# EAGLE design PLnew (EAGLE 9.4.2)
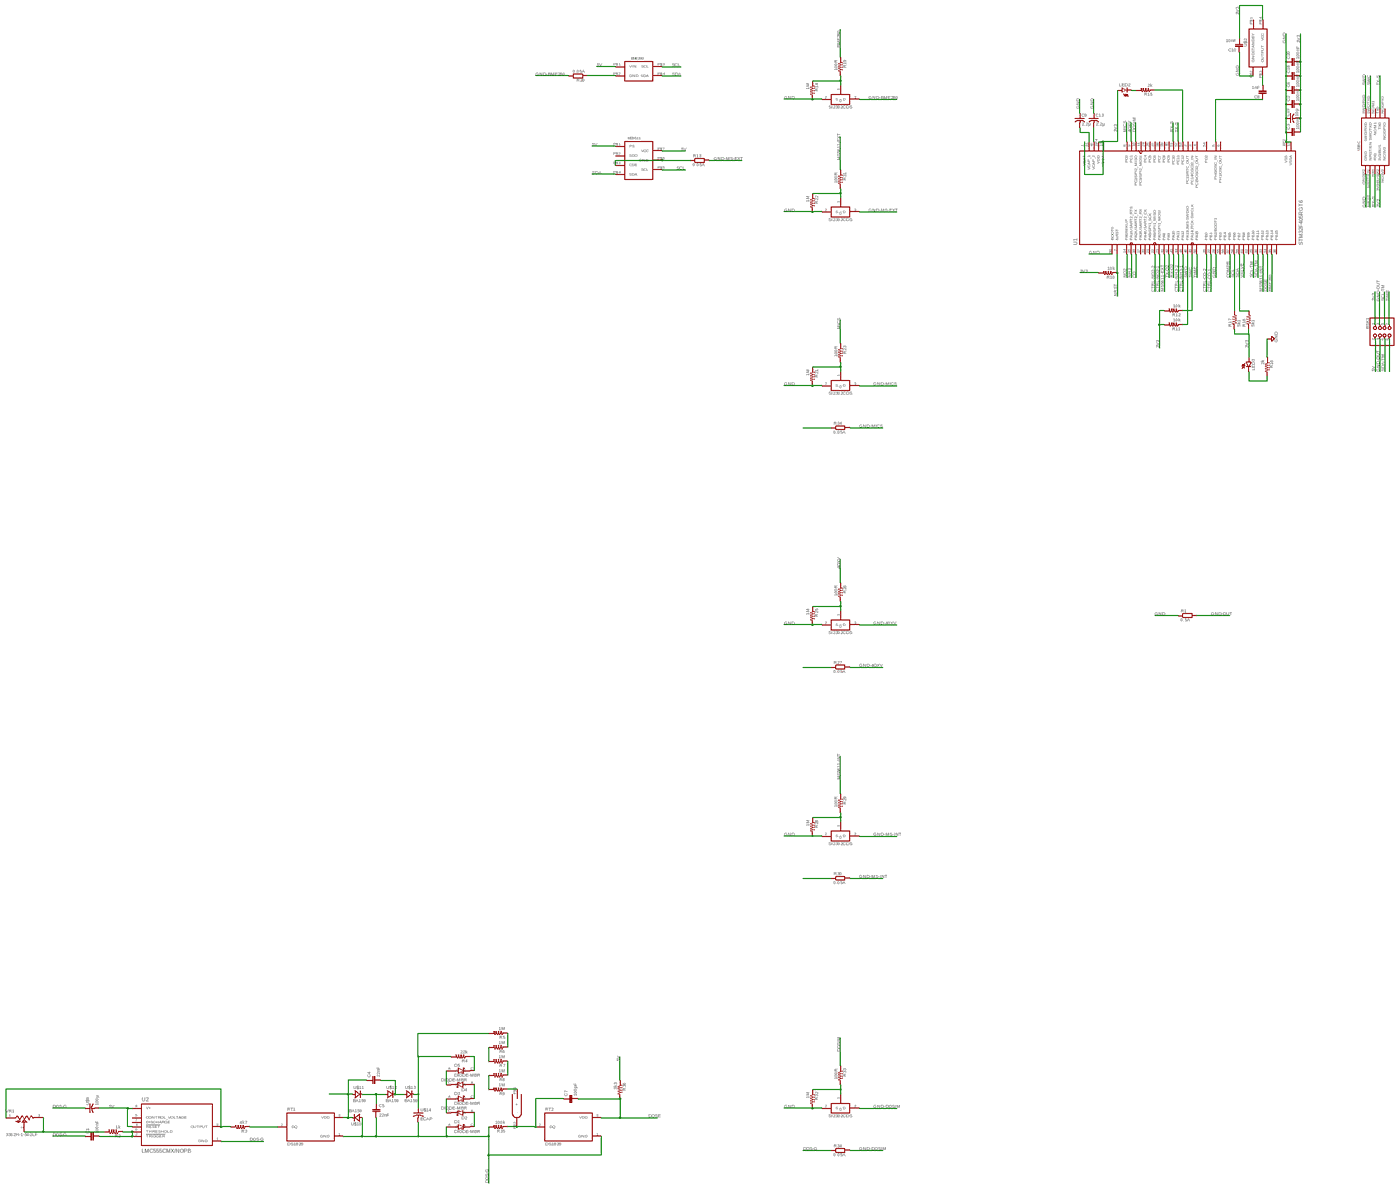
[diagram p0: schematic, sheet 1, overview]
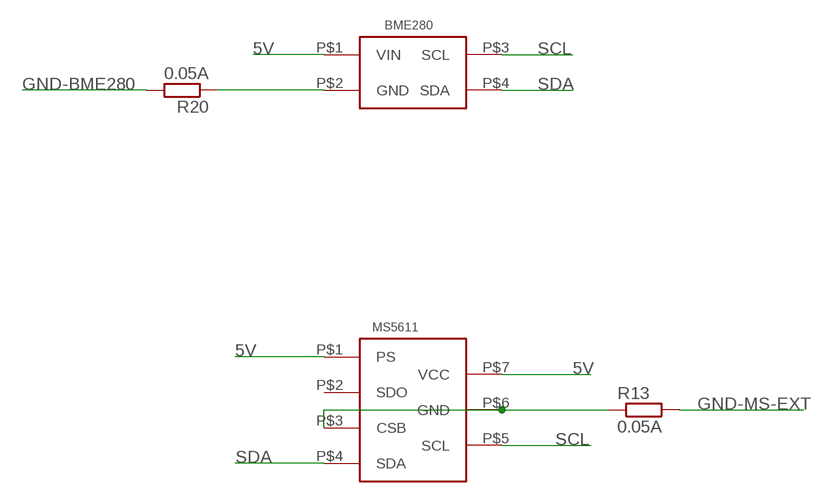
[diagram p1: schematic, sheet 1, part 1 of 4]
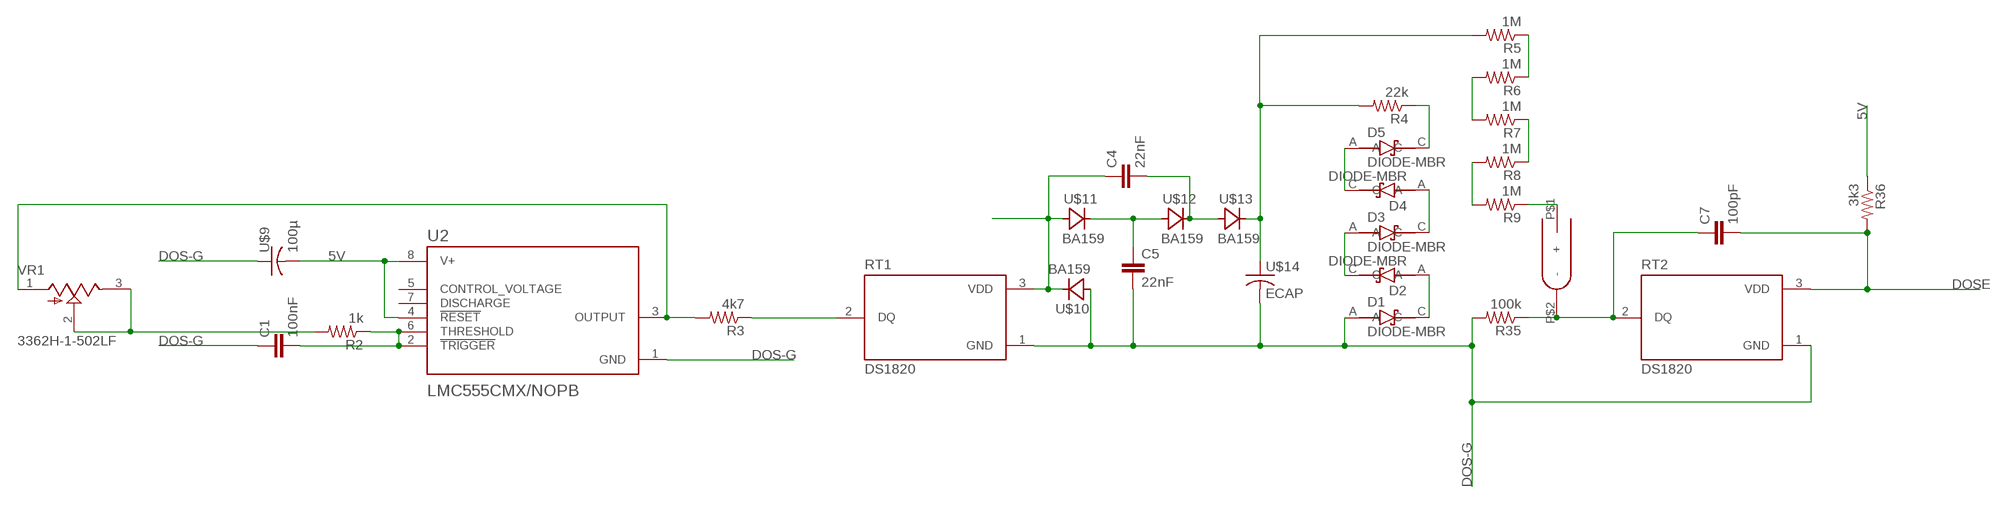
[diagram p2: schematic, sheet 1, part 2 of 4]
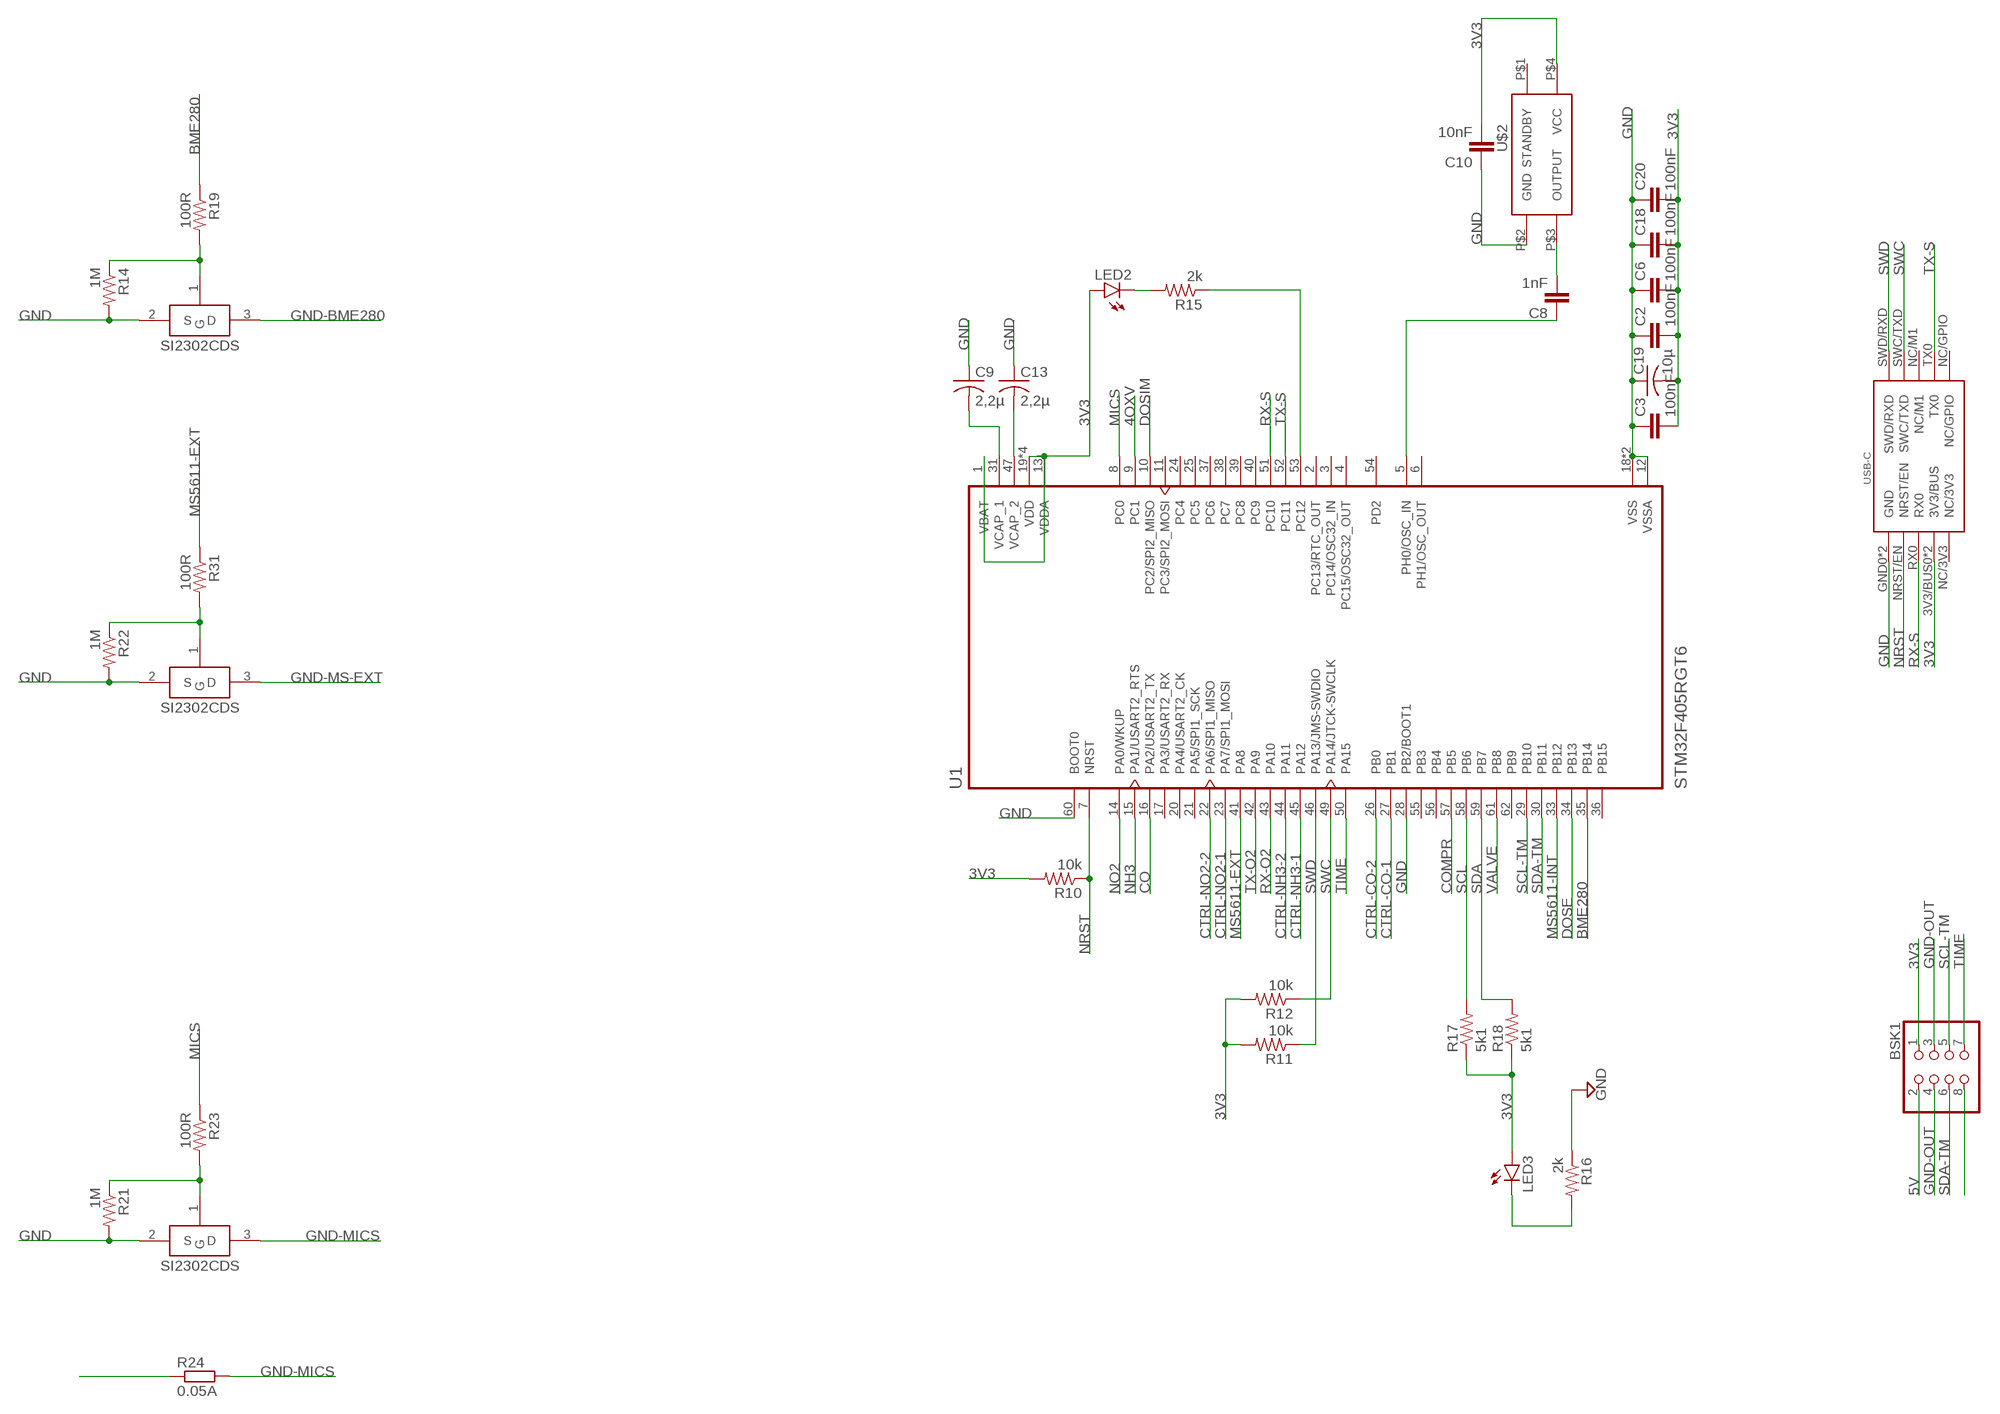
[diagram p3: schematic, sheet 1, part 3 of 4]
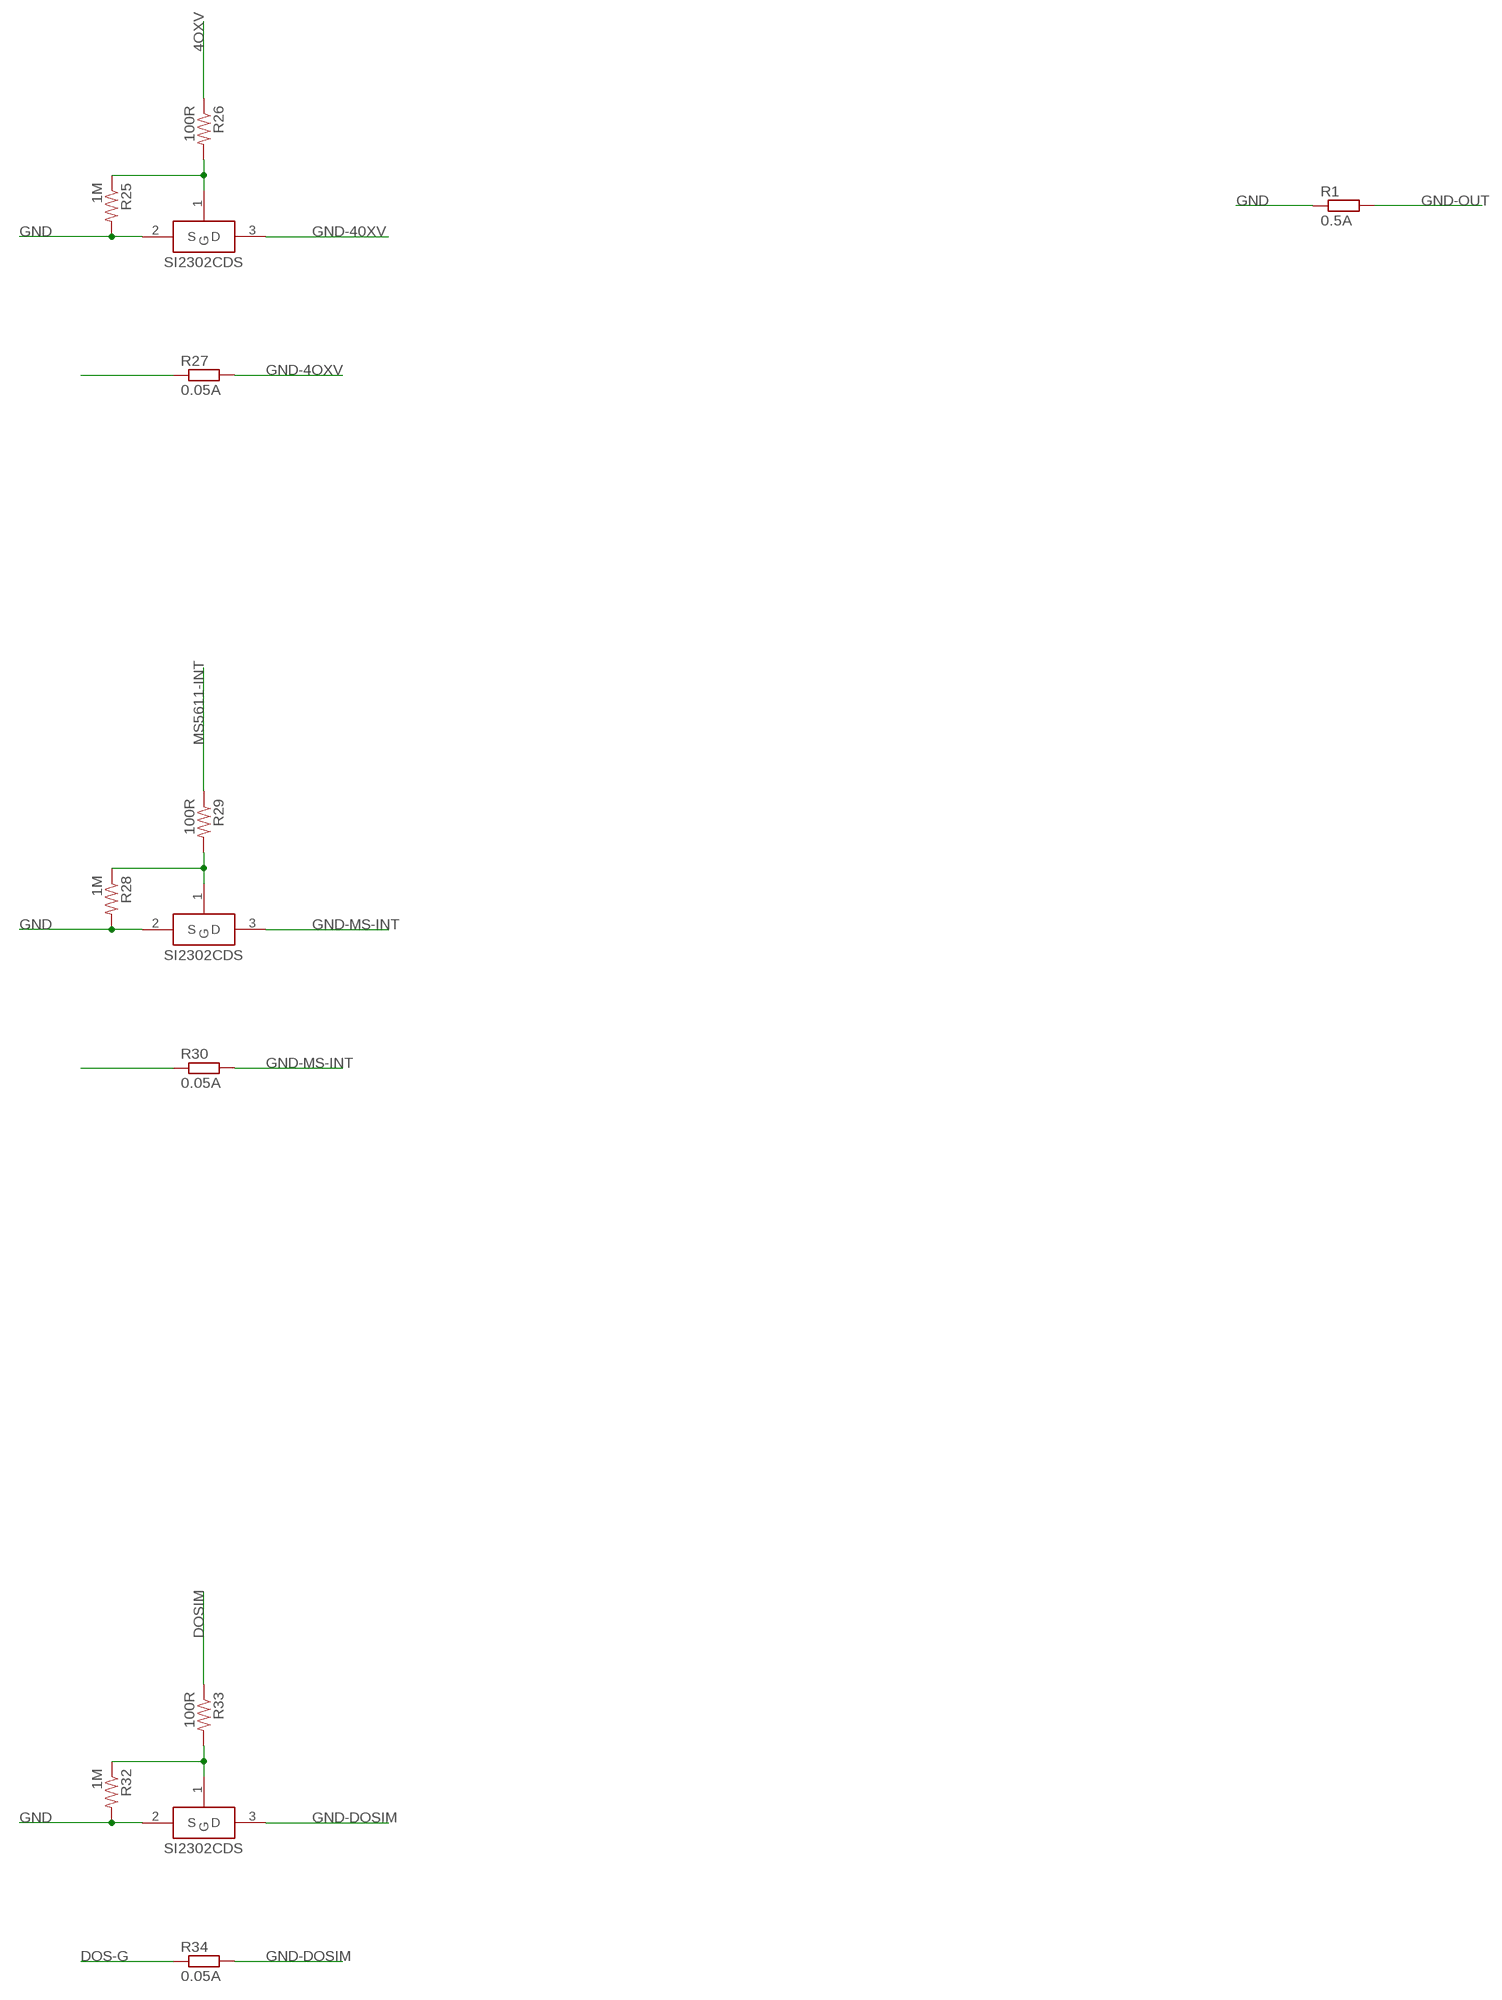
[diagram p4: schematic, sheet 1, part 4 of 4]

## Parts
BME280  BME280  [BME280]
BSK1  PINHD-2X4  [2X04]
C1  100nF  C-EUC0603  [C0603]
C2  100nF  C-EUC0603  [C0603]
C3  100nF  C-EUC0603  [C0603]
C4  22nF  C-EUC1210  [C1210]
C5  22nF  C-EUC1210  [C1210]
C6  100nF  C-EUC0603  [C0603]
C7  100pF  C-EUC0603  [C0603]
C8  1nF  C-EUC0603  [C0603]
C9  2,2µ  C-USC0603  [C0603]
C10  10nF  C-EUC0603  [C0603]
C13  2,2µ  C-USC0603  [C0603]
C18  100nF  C-EUC0603  [C0603]
C19  10µ  C-USC1206  [C1206]
C20  100nF  C-EUC0603  [C0603]
D1  DIODE-MBR  [SOD123]
D2  DIODE-MBR  [SOD123]
D3  DIODE-MBR  [SOD123]
D4  DIODE-MBR  [SOD123]
D5  DIODE-MBR  [SOD123]
LED2  LEDCHIPLED_0603  [CHIPLED_0603]
LED3  LEDCHIPLED_0603  [CHIPLED_0603]
R1  0.5A  R-EU_R1210  [R1210]
R2  1k  R-US_R0603  [R0603]
R3  4k7  R-US_R0603  [R0603]
R4  22k  R-US_R0603  [R0603]
R5  1M  R-US_R0603  [R0603]
R6  1M  R-US_R0603  [R0603]
R7  1M  R-US_R0603  [R0603]
R8  1M  R-US_R0603  [R0603]
R9  1M  R-US_R0603  [R0603]
R10  10k  R-US_R0603  [R0603]
R11  10k  R-US_R0603  [R0603]
R12  10k  R-US_R0603  [R0603]
R13  0.05A  R-EU_R1210  [R1210]
R14  1M  R-US_R0603  [R0603]
R15  2k  R-US_R0603  [R0603]
R16  2k  R-US_R0603  [R0603]
R17  5k1  R-US_R0603  [R0603]
R18  5k1  R-US_R0603  [R0603]
R19  100R  R-US_R0603  [R0603]
R20  0.05A  R-EU_R1210  [R1210]
R21  1M  R-US_R0603  [R0603]
R22  1M  R-US_R0603  [R0603]
R23  100R  R-US_R0603  [R0603]
R24  0.05A  R-EU_R1210  [R1210]
R25  1M  R-US_R0603  [R0603]
R26  100R  R-US_R0603  [R0603]
R27  0.05A  R-EU_R1210  [R1210]
R28  1M  R-US_R0603  [R0603]
R29  100R  R-US_R0603  [R0603]
R30  0.05A  R-EU_R1210  [R1210]
R31  100R  R-US_R0603  [R0603]
R32  1M  R-US_R0603  [R0603]
R33  100R  R-US_R0603  [R0603]
R34  0.05A  R-EU_R1210  [R1210]
R35  100k  R-US_R0603  [R0603]
R36  3k3  R-US_R0603  [R0603]
RT1  DS1820  [TO92/TO226]
RT2  DS1820  [TO92/TO226]
U1  STM32F405RGT6  [QFP50P1200X1200X160-64N]
U2  LMC555CMX/NOPB  [SOIC127P599X175-8N]
U$1  MS5611  [MS5611]
U$2  Q24  [Q24]
U$3  SI2302CDS  [SOT23-3]
U$4  SI2302CDS  [SOT23-3]
U$5  SI2302CDS  [SOT23-3]
U$6  USB-C  [USB-C]
U$7  SI2302CDS  [SOT23-3]
U$8  SI2302CDS  [SOT23-3]
U$9  100µ  ECAPECAP100  [ECAP100-CMD]
U$10  BA159  [BA159]
U$11  BA159  [BA159]
U$12  BA159  [BA159]
U$13  BA159  [BA159]
U$14  ECAP  [ECAP1MK]
U$15  DOSIM  [DOSIM]
U$19  SI2302CDS  [SOT23-3]
VR1  3362H-1-502LF  [TRIM_3362H-1-502LF]

## Nets
3V3: BSK1.1 C2.2 C3.2 C6.2 C10.2 C18.2 C19.2 C20.2 LED2.A LED3.A R10.2 R11.2 R12.2 R17.1 R18.1 U1.1(VBAT) U1.13(VDDA) U1.19(VDD) U1.32(VDD) U1.48(VDD) U1.64(VDD) U$2.P$4(VCC) U$6.3V3/BUS0(3V3/BUS) U$6.3V3/BUS1(3V3/BUS)
4OXV: R26.1 U1.9(PC1)
5V: BME280.P$1(VIN) BSK1.2 R36.1 U2.4(!RESET!) U2.8(V+) U$1.P$1(PS) U$1.P$7(VCC) U$9.P$2
BME280: R19.1 U1.35(PB14)
CO: U1.16(PA2/USART2_TX)
COMPR: U1.57(PB5)
CTRL-CO-1: U1.27(PB1)
CTRL-CO-2: U1.26(PB0)
CTRL-NH3-1: U1.45(PA12)
CTRL-NH3-2: U1.44(PA11)
CTRL-NO2-1: U1.23(PA7/SPI1_MOSI)
CTRL-NO2-2: U1.22(PA6/SPI1_MISO)
DOS-G: C1.1 C5.2 D1.A R34.1 R35.2 RT1.1(GND) RT2.1(GND) U2.1(GND) U$9.P$1 U$10.P$1(A) U$14.P$2
DOSE: C7.2 R36.2 RT2.3(VDD) U1.34(PB13)
DOSIM: R33.1 U1.10(PC2/SPI2_MISO)
GND: C2.1 C3.1 C6.1 C9.1 C10.1 C13.1 C18.1 C19.1 C20.1 R1.1 R14.2 R16.1 R21.2 R22.2 R25.2 R28.2 R32.2 U1.12(VSSA) U1.18(VSS) U1.28(PB2/BOOT1) U1.60(BOOT0) U1.63(VSS) U$2.P$2(GND) U$3.2(S) U$4.2(S) U$5.2(S) U$6.GND0(GND) U$6.GND1(GND) U$7.2(S) U$8.2(S) U$19.2(S)
GND-4OXV: R27.2
GND-40XV: U$5.3(D)
GND-BME280: R20.2 U$3.3(D)
GND-DOSIM: R34.2 U$8.3(D)
GND-MICS: R24.2 U$4.3(D)
GND-MS-EXT: R13.2 U$19.3(D)
GND-MS-INT: R30.2 U$7.3(D)
GND-OUT: BSK1.3 BSK1.4 R1.2
MICS: R23.1 U1.8(PC0)
MS5611-EXT: R31.1 U1.41(PA8)
MS5611-INT: R29.1 U1.33(PB12)
N$1: R13.1 U$1.P$3(CSB) U$1.P$6(GND)
N$2: R14.1 R19.2 U$3.1(G)
N$3: BME280.P$2(GND) R20.1
N$4: C8.2 U$2.P$3(OUTPUT)
N$5: C8.1 U1.5(PH0/OSC_IN)
N$6: R21.1 R23.2 U$4.1(G)
N$7: R24.1
N$8: R25.1 R26.2 U$5.1(G)
N$9: R27.1
N$10: BSK1.8
N$11: R22.1 R31.2 U$19.1(G)
N$12: R28.1 R29.2 U$7.1(G)
N$13: R30.1
N$14: R32.1 R33.2 U$8.1(G)
N$15: C1.2 R2.1 U2.2(!TRIGGER!) U2.6(THRESHOLD)
N$16: R2.2 VR1.2(WIPER) VR1.3(CW)
N$17: R3.2 U2.3(OUTPUT) VR1.1(CCW)
N$18: R3.1 RT1.2(DQ)
N$19: C4.1 RT1.3(VDD) U$10.P$2(C) U$11.P$1(A)
N$20: C5.1 U$11.P$2(C) U$12.P$1(A)
N$21: C4.2 U$12.P$2(C) U$13.P$1(A)
N$22: R4.2 R5.2 U$13.P$2(C) U$14.P$1
N$23: D1.C D2.A
N$24: D2.C D3.A
N$25: D3.C D4.A
N$26: D4.C D5.A
N$27: D5.C R4.1
N$28: R5.1 R6.1
N$29: C13.2 U1.47(VCAP_2)
N$30: R6.2 R7.2
N$31: R7.1 R8.1
N$32: R8.2 R9.2
N$33: R9.1 U$15.P$1(+)
N$34: C7.1 R35.1 RT2.2(DQ) U$15.P$2(-)
N$36: C9.2 U1.31(VCAP_1)
N$37: LED2.C R15.2
N$38: R15.1 U1.53(PC12)
N$40: LED3.C R16.2
NH3: U1.15(PA1/USART2_RTS)
NO2: U1.14(PA0/WKUP)
NRST: R10.1 U1.7(NRST) U$6.NRST/EN
RX-O2: U1.43(PA10)
RX-S: U1.51(PC10) U$6.RX0
SCL: BME280.P$3(SCL) R17.2 U1.58(PB6) U$1.P$5(SCL)
SCL-TM: BSK1.5 U1.29(PB10)
SDA: BME280.P$4(SDA) R18.2 U1.59(PB7) U$1.P$4(SDA)
SDA-TM: BSK1.6 U1.30(PB11)
SWC: R12.1 U1.49(PA14/JTCK-SWCLK) U$6.SWC/TXD
SWD: R11.1 U1.46(PA13/JMS-SWDIO) U$6.SWD/RXD
TIME: BSK1.7 U1.50(PA15)
TX-O2: U1.42(PA9)
TX-S: U1.52(PC11) U$6.TX0
VALVE: U1.61(PB8)
Unconnected: U1.2(PC13/RTC_OUT) U1.3(PC14/OSC32_IN) U1.4(PC15/OSC32_OUT) U1.6(PH1/OSC_OUT) U1.11(PC3/SPI2_MOSI) U1.17(PA3/USART2_RX) U1.20(PA4/USART2_CK) U1.21(PA5/SPI1_SCK) U1.24(PC4) U1.25(PC5) U1.36(PB15) U1.37(PC6) U1.38(PC7) U1.39(PC8) U1.40(PC9) U1.54(PD2) U1.55(PB3) U1.56(PB4) U1.62(PB9) U2.5(CONTROL_VOLTAGE) U2.7(DISCHARGE) U$1.P$2(SDO) U$2.P$1(STANDBY) U$6.NC/3V3 U$6.NC/GPIO U$6.NC/M1

## Library data of the parts
BME280 = CanCubeSat:BME280
BSK1 = pinheadCS:PINHD-2X4: PIN HEADER
C1-C8 C10 C18 C20 = rcl:C-EU: CAPACITOR, European symbol; SPICEPREFIX: C
C9 C13 C19 = rcl:C-US: CAPACITOR, American symbol; SPICEPREFIX: C
D1-D5 = CanCubeSat:DIODE-MBR: Rectifier, Schottky Power; Plastic Sod-123; 0.5 a @ +90c If; +125; 20v; 1000 Check prices <https://pricing.snapeda.com/parts/MBR0520LT1G/ON%20Semiconductor/view-part?ref=eda>; AVAILABILITY: Good; DESCRIPTION: Diode Schottky 20V 500mA Surface Mount SOD-123; MF: ON Semiconductor; MP: MBR0520LT1G; PACKAGE: SOD-123-2 ON Semiconductor; PRICE: None; PURCHASE-URL: https://pricing.snapeda.com/search/part/MBR0520LT1G/?ref=eda
LED2 LED3 = led:LED: LED OSRAM: - CHIPLED LG R971, LG N971, LY N971, LG Q971, LY Q971, LO R971, LY R971 LH N974, LH R974 LS Q976, LO Q976, LY Q976 LO Q996 - Hyper CHIPLED LW Q18S LB Q993, LB Q99A, LB R99A - SideLED LS A670, LO A670, LY A670, LG A670, LP A670 LB A673, LV A673, LT A673, LW A673 LH A674 LY A675 LS A676, LA A676, LO A676, LY A676, LW A676 LS A679, LY A679, LG A679 - Hyper Micro SIDELED® LS Y876, LA Y876, LO Y876, LY Y876 LT Y87S - SmartLED LW L88C, LW L88S LB L89C, LB L89S, LG L890 LS L89K, LO L89K, LY L89K LS L896, LA L896, LO L896, LY L896 - TOPLED LS T670, LO T670, LY T670, LG T670, LP T670 LSG T670, LSP T670, LSY T670, LOP T670, LYG T670 LG T671, LOG T671, LSG T671 LB T673, LV T673, LT T673, LW T673 LH T674 LS T676, LA T676, LO T676, LY T676, LB T676, LH T676, LSB T676, LW T676 LB T67C, LV T67C, LT T67C, LS T67K, LO T67K, LY T67K, LW E67C LS E67B, LA E67B, LO E67B, LY E67B, LB E67C, LV E67C, LT E67C LW T67C LS T679, LY T679, LG T679 LS T770, LO T770, LY T770, LG T770, LP T770 LB T773, LV T773, LT T773, LW T773 LH T774 LS E675, LA E675, LY E675, LS T675 LS T776, LA T776, LO T776, LY T776, LB T776 LHGB T686 LT T68C, LB T68C - Hyper Mini TOPLED® LB M676 - Mini TOPLED Santana® LG M470 LS M47K, LO M47K, LY M47K Source: http://www.osram.convergy.de LUXEON: - LUMILED® LXK2-PW12-R00, LXK2-PW12-S00, LXK2-PW14-U00, LXK2-PW14-V00 LXK2-PM12-R00, LXK2-PM12-S00, LXK2-PM14-U00 LXK2-PE12-Q00, LXK2-PE12-R00, LXK2-PE12-S00, LXK2-PE14-T00, LXK2-PE14-U00 LXK2-PB12-K00, LXK2-PB12-L00, LXK2-PB12-M00, LXK2-PB14-N00, LXK2-PB14-P00, LXK2-PB14-Q00 LXK2-PR12-L00, LXK2-PR12-M00, LXK2-PR14-Q00, LXK2-PR14-R00 LXK2-PD12-Q00, LXK2-PD12-R00, LXK2-PD12-S00 LXK2-PH12-R00, LXK2-PH12-S00 LXK2-PL12-P00, LXK2-PL12-Q00, LXK2-PL12-R00 Source: www.luxeon.com KINGBRIGHT: KA-3528ASYC Source: www.kingbright.com
R1 R13 R20 R24 R27 R30 R34 = rcl:R-EU_: RESISTOR, European symbol; SPICEPREFIX: R
R2-R12 R14-R19 R21-R23 R25 R26 R28 R29 R31-R33 R35 R36 = resistor:R-US_: RESISTOR, American symbol
RT1 RT2 = CanCubeSat:DS1820: Temperature Sensor Digital, Local -55°C ~ 125°C 7 b TO-92-3 Check prices <https://pricing.snapeda.com/parts/DS1820/Maxim%20Integrated/view-part?ref=eda>; AVAILABILITY: Bad; DESCRIPTION: Temperature Sensor Digital, Local -55°C ~ 125°C 9 b TO-92-3; MF: Maxim Integrated; MP: DS1820; PACKAGE: TO-226-3 Maxim; PRICE: None
U1 = STM32F405RGT6:STM32F405RGT6: High-performance foundation line, ARM Cortex-M4 core with DSP and FPU, 1 Mbyte Flash, 168 MHz CPU, ART Accelerator; DESCRIPTION: High-performance foundation line, ARM Cortex-M4 core with DSP and FPU, 1 Mbyte Flash, 168 MHz CPU, ART Accelerator; DIGI-KEY_PART_NUMBER: 497-11767-ND; DIGI-KEY_PURCHASE_URL: https://www.digikey.com/product-detail/en/stmicroelectronics/STM32F405RGT6/497-11767-ND/2754208?utm_source=snapeda&utm_medium=aggregator&utm_campaign=symbol; MF: STMicroelectronics; MP: STM32F405RGT6; PACKAGE: LQFP-64 STMicroelectronics
U2 = LMC555CMX_NOPB:LMC555CMX/NOPB: Worlds smallest 555 timer with low power, high accuracy and a Fmax of 3MHz 8-SOIC -40 to 85 Check prices <https://pricing.snapeda.com/parts/LMC555CMX/NOPB/Texas%20Instruments/view-part?ref=eda>; AVAILABILITY: Good; DESCRIPTION: Worlds smallest 555 timer with low power, high accuracy and a Fmax of 3MHz 8-SOIC -40 to 85; MF: Texas Instruments; MP: LMC555CMX/NOPB; PACKAGE: SOIC-8 Texas Instruments; PRICE: None; PURCHASE-URL: https://pricing.snapeda.com/search/part/LMC555CMX/NOPB/?ref=eda
U$1 = CanCubeSat:MS5611
U$2 = CanCubeSat:Q24
U$3-U$5 U$7 U$8 U$19 = CanCubeSat:SI2302CDS
U$6 = CanCubeSat:USB-C
U$9 U$14 = CanCubeSat:ECAP
U$10-U$13 = CanCubeSat:BA159
U$15 = CanCubeSat:DOSIM
VR1 = CanCubeSat:3362H-1-502LF: Res Cermet Trimmer 50K Ohm 10% 1/2W 1(Elec)/1(Mech)Turn 2.77mm (6.6 X 6.99 X 4.7mm) Pin Thru-Hole Tube Check prices <https://pricing.snapeda.com/parts/3362P-1-502LF/Bourns/view-part?ref=eda>; AVAILABILITY: Good; DESCRIPTION: 5 kOhms 0.5W, 1/2W PC Pins Through Hole Trimmer Potentiometer Cermet 1 Turn Top Adjustment; MF: Bourns; MP: 3362P-1-502LF; PACKAGE: 3362P-1 Bourns Inc.; PRICE: None; PURCHASE-URL: https://pricing.snapeda.com/search/part/3362P-1-502LF/?ref=eda

## Board
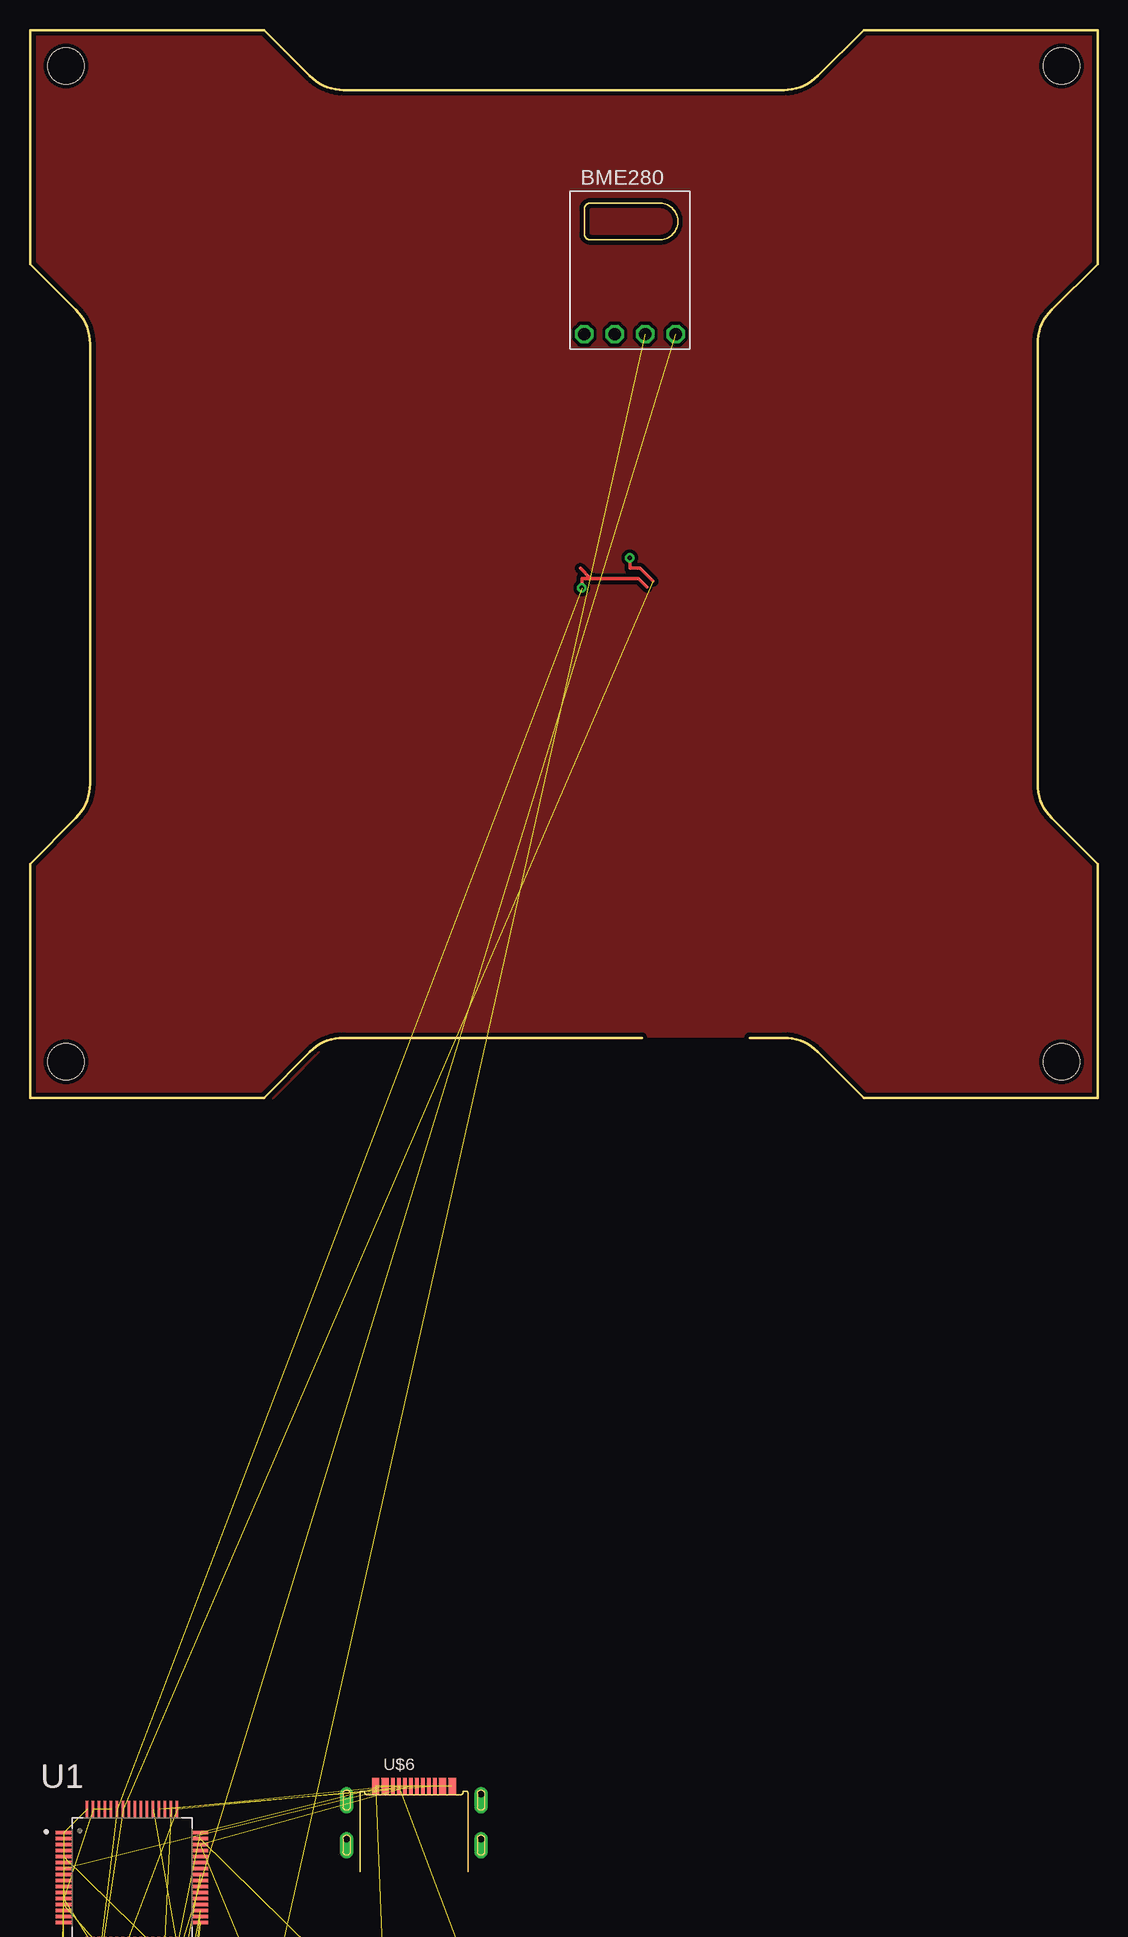
[diagram p5: board, top side]
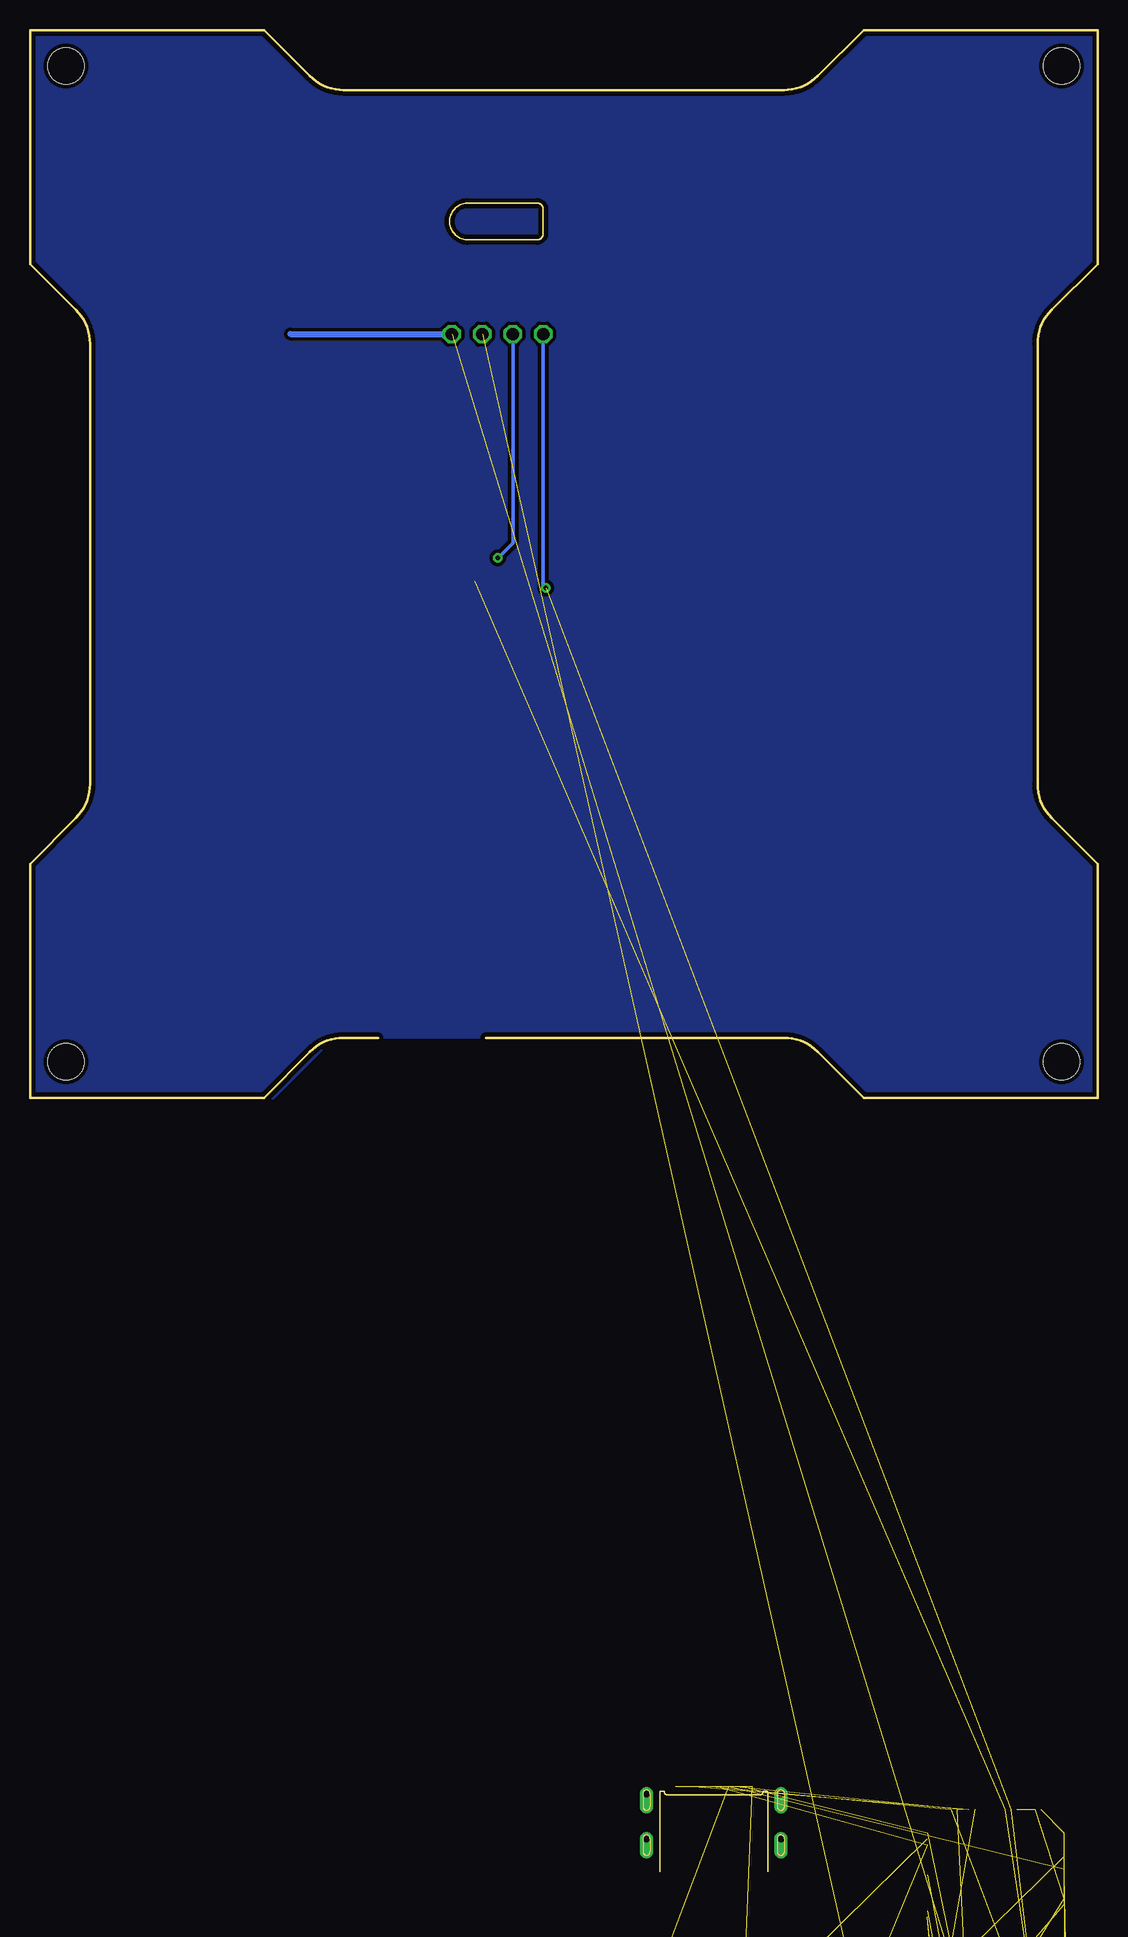
[diagram p6: board, bottom side, seen from below]

Size 89 x 153.5 mm. Coordinates in mm from the lower left corner, seen from the top.
Outline: 51,69.5 26.16,69.5 arc45 23.33,68.33 19.5,64.5 0,64.5 0,84 3.83,87.83 arc45 5,90.66 5,127.34 arc45 3.83,130.17 0,134 0,153.5 19.5,153.5 23.33,149.67 arc45 26.16,148.5 62.84,148.5 arc45 65.67,149.67 69.5,153.5 89,153.5 89,134 85.17,130.17 arc45 84,127.34 84,90.66 arc45 85.17,87.83 89,84 89,64.5 69.5,64.5 65.67,68.33 arc45 62.84,69.5 60,69.5
Copper layers (1*16): Top 0.035mm / dielectric 1.5mm / Bottom 0.035mm
Design rules "default *": minimum track width 0.3mm, minimum drill 0.35mm, track to track 0.2mm, track to pad 0.2mm, pad to pad 0.2mm, via to via 0.2mm, smd to smd 0.2mm, copper to edge 0.35mm, drill to drill 6mil, minimum pad ring 10mil, minimum via ring 8mil, stop-mask expansion 2mil, vias tented up to drill 0mil, thermal gap 10mil
Holes 3 mm at 3,67.5 86,67.5 86,150.5 3,150.5

### Footprints (pad centres in the part's own frame; a part is rotated, then mirrored left to right if it is on the bottom)
BME280 = drill 1.016 octagon: P$1 -3.81,5.33; P$2 -1.27,5.33; P$3 1.27,5.33; P$4 3.81,5.33
2X04 = drill 1.016 square: 1 -3.81,-1.27 | drill 1.016 octagon: 2 -3.81,1.27; 3 -1.27,-1.27; 4 -1.27,1.27; 5 1.27,-1.27; 6 1.27,1.27; 7 3.81,-1.27; 8 3.81,1.27
C0603 = smd 1.1 x 1: 1 -0.85,0; 2 0.85,0
C1210 = smd 1.6 x 2.7: 1 -1.4,0; 2 1.4,0
C1206 = smd 1.6 x 1.8: 1 -1.4,0; 2 1.4,0
SOD123 = smd 0.91 x 1.22: A 1.635,0; C -1.635,0
CHIPLED_0603 = smd 0.8 x 0.8: A 0,-0.75; C 0,0.75
R1210 = smd 1.6 x 2.7: 1 -1.4,0; 2 1.4,0
R0603 = smd 1 x 1.1: 1 -0.85,0; 2 0.85,0
TO92/TO226 = drill 0.8 pad 1.5: 1 -1.27,-0.95; 2 0,1; 3 1.27,-0.95
QFP50P1200X1200X160-64N = smd 1.47 x 0.28: 1 -5.67,3.75; 2 -5.67,3.25; 3 -5.67,2.75; 4 -5.67,2.25; 5 -5.67,1.75; 6 -5.67,1.25; 7 -5.67,0.75; 8 -5.67,0.25; 9 -5.67,-0.25; 10 -5.67,-0.75; 11 -5.67,-1.25; 12 -5.67,-1.75; 13 -5.67,-2.25; 14 -5.67,-2.75; 15 -5.67,-3.25; 16 -5.67,-3.75; 33 5.67,-3.75; 34 5.67,-3.25; 35 5.67,-2.75; 36 5.67,-2.25; 37 5.67,-1.75; 38 5.67,-1.25; 39 5.67,-0.75; 40 5.67,-0.25; 41 5.67,0.25; 42 5.67,0.75; 43 5.67,1.25; 44 5.67,1.75; 45 5.67,2.25; 46 5.67,2.75; 47 5.67,3.25; 48 5.67,3.75 | smd 0.28 x 1.47: 17 -3.75,-5.67; 18 -3.25,-5.67; 19 -2.75,-5.67; 20 -2.25,-5.67; 21 -1.75,-5.67; 22 -1.25,-5.67; 23 -0.75,-5.67; 24 -0.25,-5.67; 25 0.25,-5.67; 26 0.75,-5.67; 27 1.25,-5.67; 28 1.75,-5.67; 29 2.25,-5.67; 30 2.75,-5.67; 31 3.25,-5.67; 32 3.75,-5.67; 49 3.75,5.67; 50 3.25,5.67; 51 2.75,5.67; 52 2.25,5.67; 53 1.75,5.67; 54 1.25,5.67; 55 0.75,5.67; 56 0.25,5.67; 57 -0.25,5.67; 58 -0.75,5.67; 59 -1.25,5.67; 60 -1.75,5.67; 61 -2.25,5.67; 62 -2.75,5.67; 63 -3.25,5.67; 64 -3.75,5.67
SOIC127P599X175-8N = smd 1.97 x 0.6: 1 -2.47,1.905; 2 -2.47,0.635; 3 -2.47,-0.635; 4 -2.47,-1.905; 5 2.47,-1.905; 6 2.47,-0.635; 7 2.47,0.635; 8 2.47,1.905
MS5611 = drill 1.016 octagon: P$1 -7.62,5.23; P$2 -5.08,5.23; P$3 -2.54,5.23; P$4 0,5.23; P$5 2.54,5.23; P$6 5.08,5.23; P$7 7.62,5.23 | hole 3.2: -7,-4
Q24 = smd 0.3 x 1.2: P$1 -1.325,-0.85; P$2 1.325,-0.85; P$3 1.325,0.85; P$4 -1.325,0.85
SOT23-3 = smd 0.56 x 0.73: 1 -0.95,-1; 2 0.95,-1; 3 0,1
USB-C = smd 0.6 x 1.4: 3V3/BUS0 -2.4,7.1; 3V3/BUS1 2.4,7.1; GND0 -3.2,7.1; GND1 3.2,7.1 | smd 0.3 x 1.4: NC/3V3 -0.75,7.1; NC/GPIO 1.25,7.1; NC/M1 0.75,7.1; NRST/EN -1.25,7.1; RX0 -1.75,7.1; SWC/TXD 0.25,7.1; SWD/RXD -0.25,7.1; TX0 1.75,7.1 | drill 0.6 pad 1.1 offset: P$13 -5.6,6.5; P$14 -5.6,2.75; P$15 5.6,6.5; P$16 5.6,2.75
ECAP100-CMD = smd 1.2 x 3.5: P$1 0,2.85; P$2 0,-2.85
BA159 = drill 1.2 pad 2: P$1 -6,0; P$2 6,0
ECAP1MK = drill 0.8 pad 1.5: P$1 -1.25,0; P$2 1.25,0
DOSIM = drill 1.016 octagon: P$1 -1.75,0; P$2 1.75,0
TRIM_3362H-1-502LF = drill 0.714 square: 1 -1.8,1.8 | drill 0.714: 2 0,0; 3 1.8,1.8

### Placement (x,y rotation side)
BME280  50.02,133.48 180 top
BSK1  5.5,-43 0 top  (outside the outline)
C1  -6.5,-189 0 top  (outside the outline)
C2  24,-13.5 0 top  (outside the outline)
C3  30.5,-13.5 0 top  (outside the outline)
C4  -22.5,-225 0 top  (outside the outline)
C5  -22.5,-281 0 top  (outside the outline)
C6  37,-13.5 0 top  (outside the outline)
C7  -31.5,-451 0 top  (outside the outline)
C8  31,-25.5 0 top  (outside the outline)
C9  32,-20.5 0 top  (outside the outline)
C10  26.5,-20.5 0 top  (outside the outline)
C13  37,-20.5 0 top  (outside the outline)
C18  43.5,-13.5 0 top  (outside the outline)
C19  12.5,-14 0 top  (outside the outline)
C20  1.5,-20.5 0 top  (outside the outline)
D1  -21.5,-306 0 top  (outside the outline)
D2  -21.5,-311.5 0 top  (outside the outline)
D3  -21.5,-317 0 top  (outside the outline)
D4  -21.5,-322.5 0 top  (outside the outline)
D5  -21.5,-328 0 top  (outside the outline)
LED2  17.5,-14.5 0 top  (outside the outline)
LED3  21,-14.5 0 top  (outside the outline)
R1  3,-182.5 0 top  (outside the outline)
R2  -6.5,-194 0 top  (outside the outline)
R3  -15,-209 0 top  (outside the outline)
R4  -23.5,-333.5 0 top  (outside the outline)
R5  -23.5,-338.5 0 top  (outside the outline)
R6  -23.5,-343.5 0 top  (outside the outline)
R7  -23.5,-348.5 0 top  (outside the outline)
R8  -23.5,-353.5 0 top  (outside the outline)
R9  -23.5,-358.5 0 top  (outside the outline)
R10  42,-20.5 0 top  (outside the outline)
R11  26.5,-25.5 0 top  (outside the outline)
R12  1.5,-25.5 0 top  (outside the outline)
R13  3,-65 0 top  (outside the outline)
R14  1.5,-81.5 0 top  (outside the outline)
R15  16.5,-25.5 0 top  (outside the outline)
R16  21.5,-25.5 0 top  (outside the outline)
R17  1.5,-30.5 0 top  (outside the outline)
R18  1.5,-35.5 0 top  (outside the outline)
R19  1.5,-76.5 0 top  (outside the outline)
R20  3,-92.5 0 top  (outside the outline)
R21  1.5,-104 0 top  (outside the outline)
R22  7.5,-71.5 0 top  (outside the outline)
R23  1.5,-99 0 top  (outside the outline)
R24  3,-175 0 top  (outside the outline)
R25  7.5,-129 0 top  (outside the outline)
R26  1.5,-129 0 top  (outside the outline)
R27  3,-122.5 0 top  (outside the outline)
R28  7.5,-146.5 0 top  (outside the outline)
R29  1.5,-146.5 0 top  (outside the outline)
R30  3,-140 0 top  (outside the outline)
R31  1.5,-71.5 0 top  (outside the outline)
R32  7.5,-164 0 top  (outside the outline)
R33  1.5,-164 0 top  (outside the outline)
R34  3,-157.5 0 top  (outside the outline)
R35  -23.5,-425 0 top  (outside the outline)
R36  -31.5,-446 0 top  (outside the outline)
RT1  -1.27,-438.65 0 top  (outside the outline)
RT2  -29.5,-438.5 0 top  (outside the outline)
U1  8.5,-0.5 0 top
U2  -4,-181.5 0 top  (outside the outline)
U$1  9.5,-54.5 0 top  (outside the outline)
U$2  36.5,-26.5 0 top  (outside the outline)
U$3  4,-85.5 0 top  (outside the outline)
U$4  4,-108 0 top  (outside the outline)
U$5  4,-133 0 top  (outside the outline)
U$6  32,0 0 top
U$7  4,-150.5 0 top  (outside the outline)
U$8  4,-168 0 top  (outside the outline)
U$9  0,-296.55 0 top  (outside the outline)
U$10  -6,-237.7 0 top  (outside the outline)
U$11  -6,-250.4 0 top  (outside the outline)
U$12  -6,-263.1 0 top  (outside the outline)
U$13  -6,-275.8 0 top  (outside the outline)
U$14  -22.5,-302.5 0 top  (outside the outline)
U$15  -19.5,-362 0 top  (outside the outline)
U$19  9.5,-63.5 0 top  (outside the outline)
VR1  -12.5,-190.5 0 top  (outside the outline)

### Tracks (layer width: path | path; a pad name or v marks a point on that pad's centre or on a via)
3V3  (23 unrouted)
4OXV  (1 unrouted)
5V  (7 unrouted)
  Bottom 0.5: 67.28,128.15 BME280.P$1
BME280  (1 unrouted)
DOS-G  (10 unrouted)
DOSE  (3 unrouted)
DOSIM  (1 unrouted)
GND  (30 unrouted)
  pour Top (isolate 0.3, no thermals): -0.05,153.55 19.85,153.55 24.75,148.65 64.2,148.65 69.1,153.55 88.95,153.55 88.95,133.95 84.25,129.25 84.25,128.65 83.95,128.35 83.95,89.75 84.35,89.35 89,83.98 89,64.5 69.5,64.5 65.05,68.95 64.55,68.95 64.15,69.35 63.65,69.35 63.45,69.55 25.37,69.55 20.27,64.45 0.25,64.45 0.05,64.65 0.05,84.15 4.15,88.25 4.15,88.45 4.65,88.95 4.65,89.45 4.85,89.65 4.85,128.65 4.55,128.95 4.55,129.45 -0.05,134.05
  pour Bottom (isolate 0.3, no thermals): 89.05,153.5 69.15,153.5 64.25,148.6 24.8,148.6 19.9,153.5 0.05,153.5 0.05,133.9 4.75,129.2 4.75,128.6 5.05,128.3 5.05,89.7 4.65,89.3 0,83.93 0,64.45 19.5,64.45 23.95,68.9 24.45,68.9 24.85,69.3 25.35,69.3 25.55,69.5 63.63,69.5 68.73,64.4 88.75,64.4 88.95,64.6 88.95,84.1 84.85,88.2 84.85,88.4 84.35,88.9 84.35,89.4 84.15,89.6 84.15,128.6 84.45,128.9 84.45,129.4 89.05,134
GND-BME280  (1 unrouted)
GND-DOSIM  (1 unrouted)
GND-MICS  (1 unrouted)
GND-MS-EXT  (1 unrouted)
GND-MS-INT  (1 unrouted)
GND-OUT  (2 unrouted)
MICS  (1 unrouted)
MS5611-EXT  (1 unrouted)
MS5611-INT  (1 unrouted)
N$1  (2 unrouted)
N$2  (2 unrouted)
N$3  (1 unrouted)
N$4  (1 unrouted)
N$5  (1 unrouted)
N$6  (2 unrouted)
N$8  (2 unrouted)
N$11  (2 unrouted)
N$12  (2 unrouted)
N$14  (2 unrouted)
N$15  (3 unrouted)
N$16  (2 unrouted)
N$17  (2 unrouted)
N$18  (1 unrouted)
N$19  (3 unrouted)
N$20  (2 unrouted)
N$21  (2 unrouted)
N$22  (3 unrouted)
N$23  (1 unrouted)
N$24  (1 unrouted)
N$25  (1 unrouted)
N$26  (1 unrouted)
N$27  (1 unrouted)
N$28  (1 unrouted)
N$29  (1 unrouted)
N$30  (1 unrouted)
N$31  (1 unrouted)
N$32  (1 unrouted)
N$33  (1 unrouted)
N$34  (3 unrouted)
N$36  (1 unrouted)
N$37  (1 unrouted)
N$38  (1 unrouted)
N$40  (1 unrouted)
NRST  (2 unrouted)
RX-S  (1 unrouted)
SCL  (via drill 0.35)  (3 unrouted)
  Top 0.3: 51.95,107.55 50.86,108.64 50,108.64 v50,109.5
  Bottom 0.3: BME280.P$3 48.75,110.75 v50,109.5
SCL-TM  (1 unrouted)
SDA  (via drill 0.35)  (3 unrouted)
  Top 0.3: 45.88,108.64 46.73,107.79 | 46.73,107.79 47,107.79 50.71,107.79 51.45,107.05 | 46.73,107.79 46,107.79 v46,107
  Bottom 0.3: BME280.P$4 46.21,107.21 v46,107
SDA-TM  (1 unrouted)
SWC  (2 unrouted)
SWD  (2 unrouted)
TIME  (1 unrouted)
TX-S  (1 unrouted)